# Altium schematic sheet mcu.SchDoc
size A4
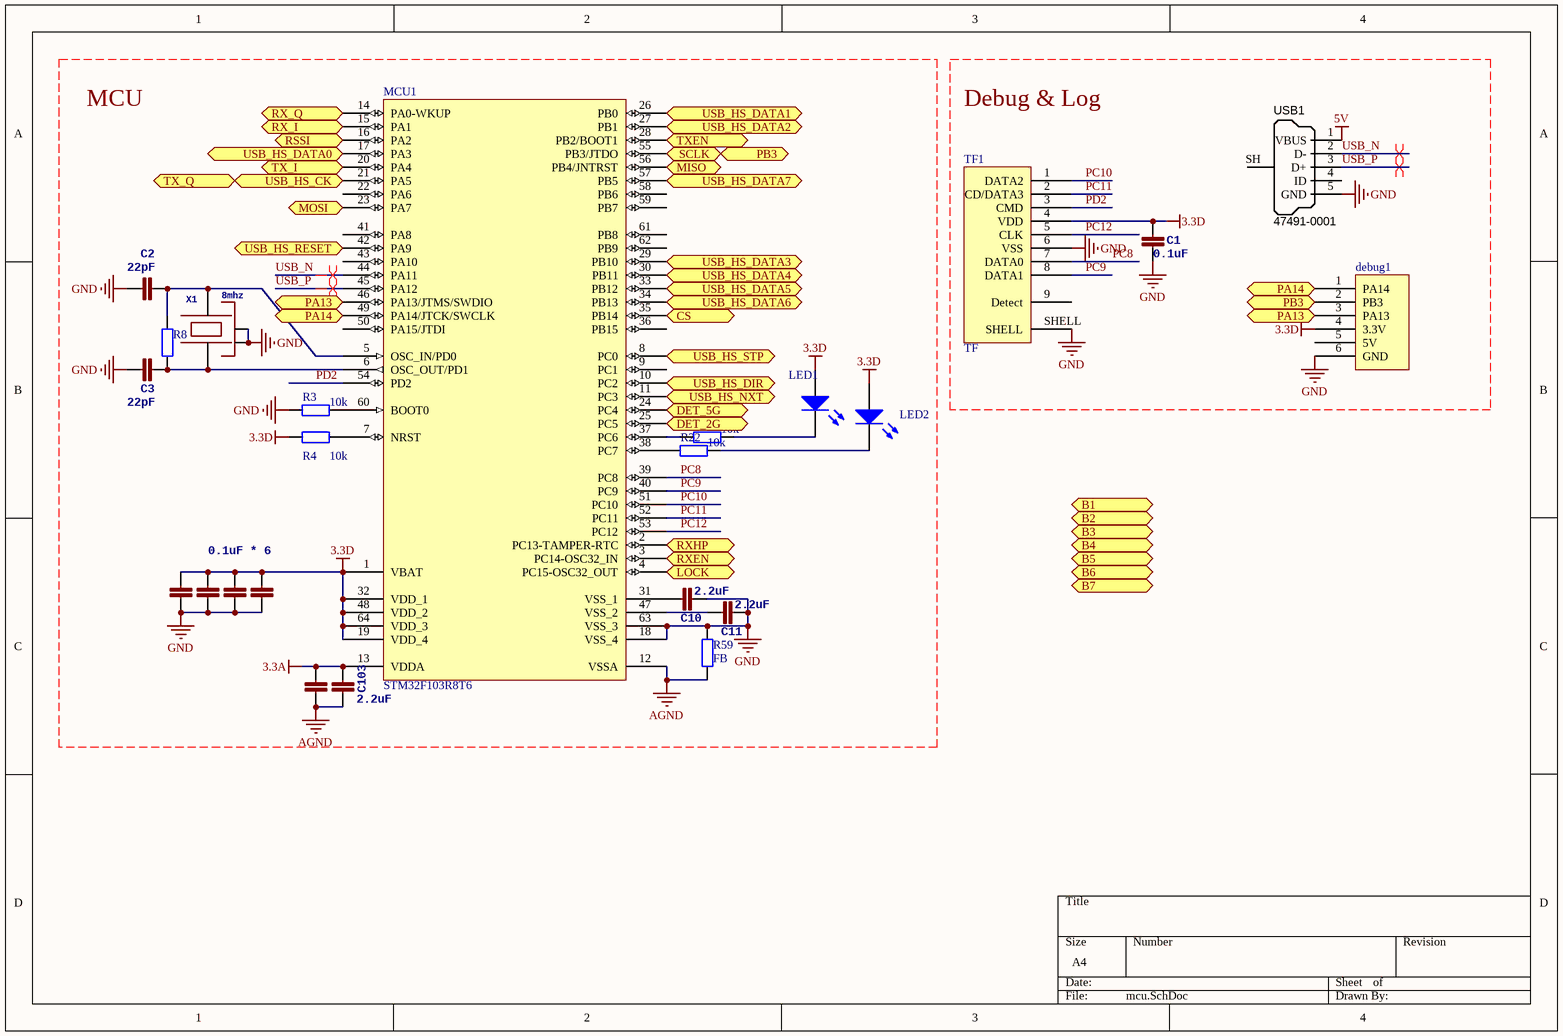
[diagram p0: mcu.SchDoc]

## Parts
C1  0.1uF  [0402]
C2  22pF  [0402]
C3  22pF  [0402]
C4  0.1uF * 6  [0402]
C5  1n  [0402]  (value not drawn)
C6  1n  [0402]  (value not drawn)
C7  1n  [0402]  (value not drawn)
C10  2.2uF  [0603]
C11  2.2uF  [0603]
C102  1n  [0402]  (value not drawn)
C103  2.2uF  [0603]
debug1  debug  [WFRSM125]  (value not drawn)
LED1  LED0  [0603]  (value not drawn)
LED2  LED0  [0603]  (value not drawn)
MCU1  STM32F103R8T6  [LQFP64_N]
R3  10k  [0402]
R4  10k  [0402]
R8  (no value)  [0402]
R21  10k  [0402]
R22  10k  [0402]
R59  FB  [0402]
TF1  TF  [TF]
USB1  Manufacturer Part Number 1: 47491-0001  [MICRO-YZX]  (hidden comment: USB Micro Type B)
X1  8mhz  [OSCILLATOR-3.2X2.5]

## Ports
B1, B2, B3, B4, B5, B6, B7, CS, DET_2G, DET_5G, LOCK, MISO, MOSI, PA13, PA14, PB3, RSSI, RX_I, RX_Q, RXEN, RXHP, SCLK, TX_I, TX_Q, TXEN, USB_HS_CK, USB_HS_DATA0, USB_HS_DATA1, USB_HS_DATA2, USB_HS_DATA3, USB_HS_DATA4, USB_HS_DATA5, USB_HS_DATA6, USB_HS_DATA7, USB_HS_DIR, USB_HS_NXT, USB_HS_RESET, USB_HS_STP

## Nets
3.3A: C102.2 C103.2 MCU1.13(VDDA)
3.3D: C1.2 C4.2 C5.2 C6.2 C7.2 debug1.4(3.3V) LED1.1(A) LED2.1(A) MCU1.1(VBAT) MCU1.19(VDD_4) MCU1.32(VDD_1) MCU1.48(VDD_2) MCU1.64(VDD_3) R4.2 TF1.4(VDD)
5V: USB1.1(VBUS)
AGND: C102.1 C103.1 MCU1.12(VSSA) R59.2
GND: C1.1 C2.2 C3.2 C4.1 C5.1 C6.1 C7.1 C10.2 C11.2 debug1.6(GND) MCU1.18(VSS_4) MCU1.63(VSS_3) R3.1 R59.1 TF1.6(VSS) TF1.SHELL USB1.5(GND) X1.2(NC_2) X1.4(NC_4)
CS: MCU1.35(PB14) ; port CS
DET_2G: MCU1.25(PC5) ; port DET_2G
DET_5G: MCU1.24(PC4) ; port DET_5G
LOCK: MCU1.4(PC15-OSC32_OUT) ; port LOCK
MISO: MCU1.56(PB4/JNTRST) ; port MISO
MOSI: MCU1.23(PA7) ; port MOSI
PA13: debug1.3(PA13) MCU1.46(PA13/JTMS/SWDIO) ; port PA13
PA14: debug1.1(PA14) MCU1.49(PA14/JTCK/SWCLK) ; port PA14
PB3: debug1.2(PB3) MCU1.55(PB3/JTDO) ; port SCLK, port PB3
PC8: MCU1.39(PC8) TF1.7(DATA0)
PC9: MCU1.40(PC9) TF1.8(DATA1)
PC10: MCU1.51(PC10) TF1.1(DATA2)
PC11: MCU1.52(PC11) TF1.2(CD/DATA3)
PC12: MCU1.53(PC12) TF1.5(CLK)
PD2: MCU1.54(PD2) TF1.3(CMD)
RSSI: MCU1.16(PA2) ; port RSSI
RX_I: MCU1.15(PA1) ; port RX_I
RX_Q: MCU1.14(PA0-WKUP) ; port RX_Q
RXEN: MCU1.3(PC14-OSC32_IN) ; port RXEN
RXHP: MCU1.2(PC13-TAMPER-RTC) ; port RXHP
TX_I: MCU1.20(PA4) ; port TX_I
TX_Q: MCU1.21(PA5) ; port USB_HS_CK, port TX_Q
TXEN: MCU1.28(PB2/BOOT1) ; port TXEN
USB_HS_DATA0: MCU1.17(PA3) ; port USB_HS_DATA0
USB_HS_DATA1: MCU1.26(PB0) ; port USB_HS_DATA1
USB_HS_DATA2: MCU1.27(PB1) ; port USB_HS_DATA2
USB_HS_DATA3: MCU1.29(PB10) ; port USB_HS_DATA3
USB_HS_DATA4: MCU1.30(PB11) ; port USB_HS_DATA4
USB_HS_DATA5: MCU1.33(PB12) ; port USB_HS_DATA5
USB_HS_DATA6: MCU1.34(PB13) ; port USB_HS_DATA6
USB_HS_DATA7: MCU1.57(PB5) ; port USB_HS_DATA7
USB_HS_DIR: MCU1.10(PC2) ; port USB_HS_DIR
USB_HS_NXT: MCU1.11(PC3) ; port USB_HS_NXT
USB_HS_RESET: MCU1.42(PA9) ; port USB_HS_RESET
USB_HS_STP: MCU1.8(PC0) ; port USB_HS_STP
USB_N: MCU1.44(PA11) USB1.2(D-)
USB_P: MCU1.45(PA12) USB1.3(D+)
NetC2_1: C2.1 MCU1.5(OSC_IN/PD0) R8.2 X1.3
NetC3_1: C3.1 MCU1.6(OSC_OUT/PD1) R8.1 X1.1
NetC10_1: C10.1 MCU1.31(VSS_1)
NetC11_1: C11.1 MCU1.47(VSS_2)
NetLED1_2: LED1.2(K) R21.2
NetLED2_2: LED2.2(K) R22.2
NetMCU1_7: MCU1.7(NRST) R4.1
NetMCU1_37: MCU1.37(PC6) R21.1
NetMCU1_38: MCU1.38(PC7) R22.1
NetMCU1_60: MCU1.60(BOOT0) R3.2

Not connected (* = marked no-connect by the designer): debug1 5(5V); MCU1 9(PC1) 22(PA6) 36(PB15) 41(PA8) 43(PA10) 50(PA15/JTDI) 58(PB6) 59(PB7) 61(PB8) 62(PB9); TF1 9(Detect); USB1 4(ID) SH(Shell)

## Layout directives
differential pair: USB_N, USB_P

## Notes on the sheet
- MCU
- Debug & Log

## Library data of the parts
C1-C7 C10 C11 C102 C103 = CAP0402-CAP: <b>Capacitor</b> / Standard 0603 ceramic capacitor, and 0.1" leaded capacitor.; PARTNO: CC0402ZRY5V7BB104
LED1 LED2 = LED0: Typical INFRARED GaAs LED; Published: 8-Jun-2000; LatestRevisionDate: 08-Jul-2005; LatestRevisionNote: Mech Layer 1 removed.; PackageReference: LED-0; Publisher: Altium Limited; PackageDescription: LED; 2 Leads
MCU1 = STM32F103R8T6: STM32 ARM-based 32-bit MCU with 64 Kbytes Flash, 64-pin LQFP, Industrial Temperature; Published: *; DatasheetVersion: *; PackageVersion: *; PackageReference: *; Publisher: *; PackageDescription: *; ComponentLink1Description: *; ComponentLink1URL: *; ComponentLink2Description: *; ComponentLink2URL: *
R3 R4 R8 R21 R22 R59 = Res2: Resistor; Value: 0Ohm; Published: 8-Jun-2000; LatestRevisionDate: 17-Jul-2002; LatestRevisionNote: Re-released for DXP Platform.; PackageReference: AXIAL-0.4; Publisher: Altium Limited; PackageDescription: Axial Device, Thru-Hole; 2 Leads; 0.4 in Pin Spacing
USB1 = USB_Micro_TypeB: Connector SMD USB Micro Type B middle mount; Manufacturer 1: Molex Inc; SCDType: undef; Package / Case: SMD; Supplier 1: Digi-Key; Supplier Part Number 1: WM17142CT-ND
X1 = OSCILLATOR-3.2X2.5: Crystal Oscillator in 3.2x2.5 SMD